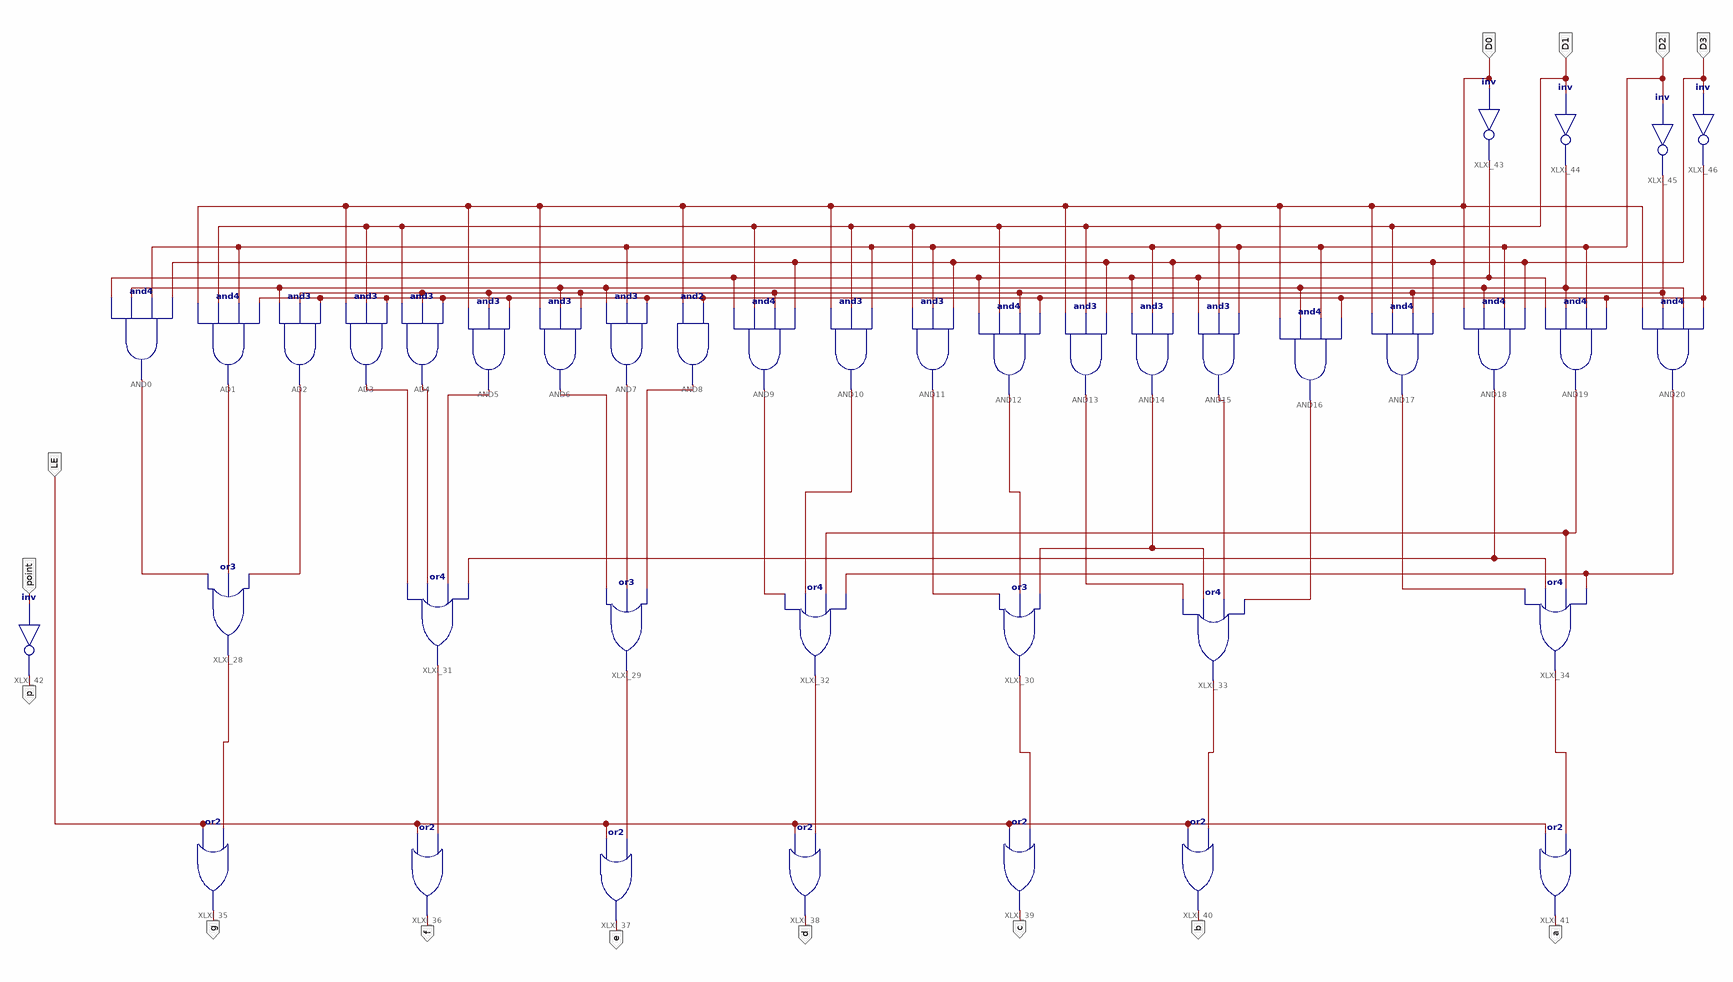
[diagram p0: schematic sheet 1]
// Xilinx ISE schematic MC14495_ZJU.sch (kintex7) as structural Verilog: 40 symbols, 14 ports
module MC14495_ZJU (
  input  D2,
  input  D3,
  input  D0,
  input  D1,
  input  LE,
  input  point,
  output p,
  output g,
  output f,
  output e,
  output d,
  output c,
  output b,
  output a
);

  wire XLXN_1, XLXN_2, XLXN_14, XLXN_15, XLXN_18, XLXN_19, XLXN_20, XLXN_21, XLXN_22, XLXN_23, XLXN_24,
       XLXN_25, XLXN_26, XLXN_27, XLXN_37, XLXN_38, XLXN_39, XLXN_44, XLXN_46, XLXN_47, XLXN_48, XLXN_49,
       XLXN_51, XLXN_52, XLXN_53, XLXN_60, XLXN_61, XLXN_62, XLXN_63, XLXN_65, XLXN_66, XLXN_67;

  and AND0 (XLXN_18, XLXN_1, XLXN_2, D2, D3);
  and AD1 (XLXN_19, D0, D1, D2, XLXN_14);
  and AD2 (XLXN_20, XLXN_2, XLXN_15, XLXN_14);
  and AD3 (XLXN_21, D0, D1, XLXN_14);
  and AD4 (XLXN_22, D1, XLXN_15, XLXN_14);
  and AND5 (XLXN_23, D0, XLXN_15, XLXN_14);
  and AND6 (XLXN_25, D0, XLXN_2, XLXN_15);
  and AND7 (XLXN_26, XLXN_2, D2, XLXN_14);
  and AND8 (XLXN_27, D0, XLXN_14);
  and AND9 (XLXN_37, XLXN_1, D1, XLXN_15, D3);
  and AND10 (XLXN_38, D0, D1, D2);
  and AND11 (XLXN_47, D1, D2, D3);
  and AND12 (XLXN_48, XLXN_1, D1, XLXN_15, XLXN_14);
  and AND13 (XLXN_51, D0, D1, D3);
  and AND14 (XLXN_49, XLXN_1, D2, D3);
  and AND15 (XLXN_52, XLXN_1, D1, D2);
  and AND16 (XLXN_53, D0, XLXN_2, D2, XLXN_14);
  and AND17 (XLXN_46, D0, D1, XLXN_15, D3);
  and AND18 (XLXN_24, D0, XLXN_2, D2, D3);
  and AND19 (XLXN_39, XLXN_1, XLXN_2, D2, XLXN_14);
  and AND20 (XLXN_44, D0, XLXN_15, XLXN_2, XLXN_14);
  or XLXI_28 (XLXN_60, XLXN_18, XLXN_19, XLXN_20);
  or XLXI_29 (XLXN_62, XLXN_25, XLXN_26, XLXN_27);
  or XLXI_30 (XLXN_65, XLXN_47, XLXN_48, XLXN_49);
  or XLXI_31 (XLXN_61, XLXN_21, XLXN_22, XLXN_23, XLXN_24);
  or XLXI_32 (XLXN_63, XLXN_37, XLXN_38, XLXN_39, XLXN_44);
  or XLXI_33 (XLXN_66, XLXN_51, XLXN_49, XLXN_52, XLXN_53);
  or XLXI_34 (XLXN_67, XLXN_46, XLXN_24, XLXN_39, XLXN_44);
  or XLXI_35 (g, LE, XLXN_60);
  or XLXI_36 (f, LE, XLXN_61);
  or XLXI_37 (e, LE, XLXN_62);
  or XLXI_38 (d, LE, XLXN_63);
  or XLXI_39 (c, LE, XLXN_65);
  or XLXI_40 (b, LE, XLXN_66);
  or XLXI_41 (a, LE, XLXN_67);
  not XLXI_42 (p, point);
  not XLXI_43 (XLXN_1, D0);
  not XLXI_44 (XLXN_2, D1);
  not XLXI_45 (XLXN_15, D2);
  not XLXI_46 (XLXN_14, D3);
endmodule
